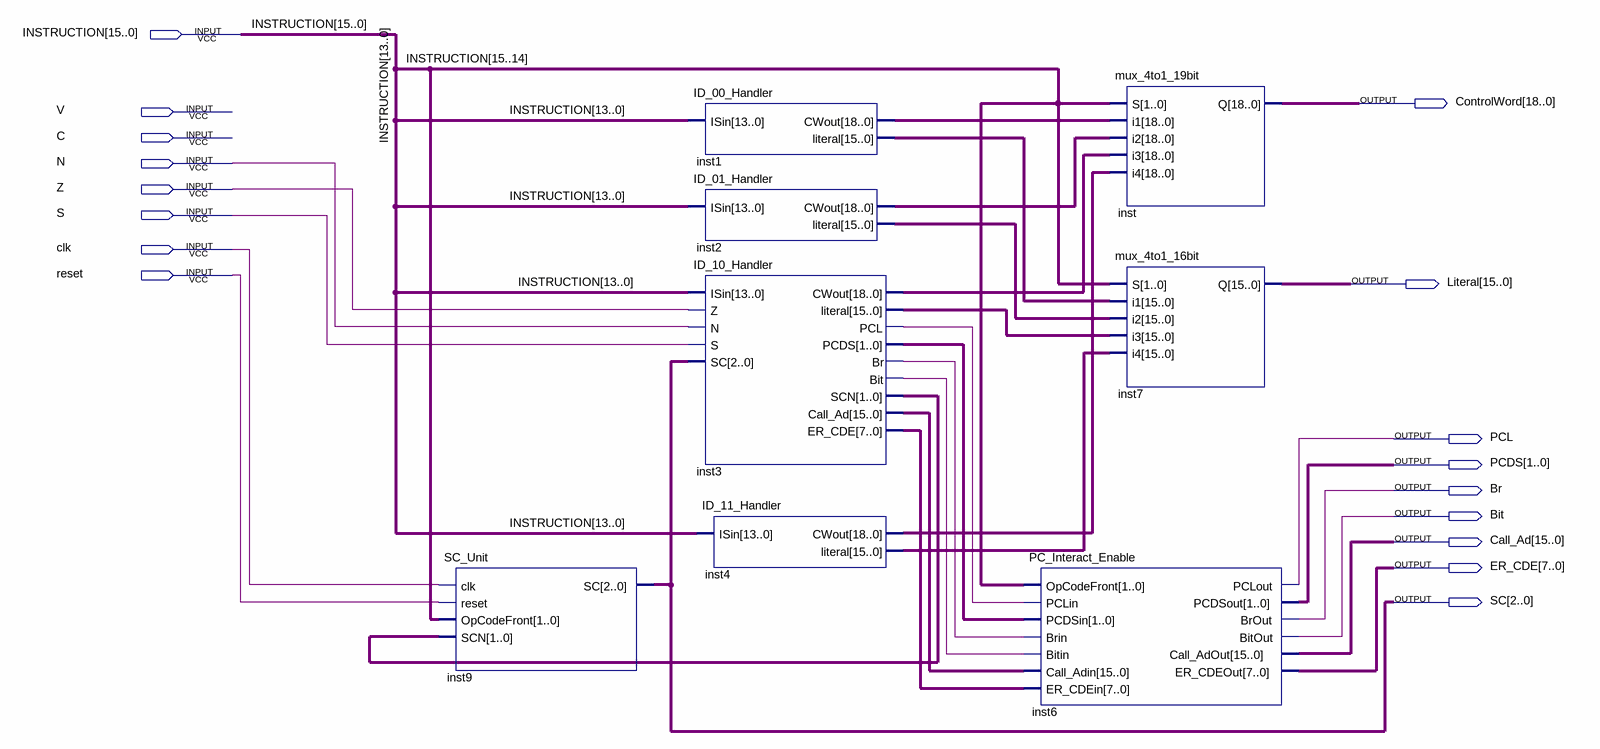
[diagram p0: schematic sheet]
// Quartus schematic InstructionDecoder.bdf as structural Verilog: 8 symbols, 17 pins
module InstructionDecoder (
  input  [15:0] INSTRUCTION,
  input  V,
  input  C,
  input  N,
  input  Z,
  input  S,
  input  clk,
  input  reset,
  output [18:0] ControlWord,
  output [15:0] Literal,
  output PCL,
  output [1:0] PCDS,
  output Br,
  output Bit,
  output [15:0] Call_Ad,
  output [7:0] ER_CDE,
  output [2:0] SC
);

  wire inst3_bit, inst3_br, inst3_pcl;
  wire [1:0] inst3_pcds, inst3_scn;
  wire [7:0] inst3_er_cde;
  wire [15:0] inst1_literal, inst2_literal, inst3_call_ad, inst3_literal, inst4_literal;
  wire [18:0] inst1_cwout, inst2_cwout, inst3_cwout, inst4_cwout;

  SC_Unit inst9 (.clk(clk), .reset(reset), .OpCodeFront(INSTRUCTION), .SCN(inst3_scn), .SC(SC));
  ID_00_Handler inst1 (.ISin(INSTRUCTION[13:0]), .CWout(inst1_cwout), .literal(inst1_literal));
  ID_01_Handler inst2 (.ISin(INSTRUCTION[13:0]), .CWout(inst2_cwout), .literal(inst2_literal));
  ID_10_Handler inst3 (
    .ISin(INSTRUCTION[13:0]), .Z(Z), .N(N), .S(S), .SC(SC), .CWout(inst3_cwout), .literal(inst3_literal),
    .PCL(inst3_pcl), .PCDS(inst3_pcds), .Br(inst3_br), .Bit(inst3_bit), .SCN(inst3_scn),
    .Call_Ad(inst3_call_ad), .ER_CDE(inst3_er_cde));
  ID_11_Handler inst4 (.ISin(INSTRUCTION[13:0]), .CWout(inst4_cwout), .literal(inst4_literal));
  PC_Interact_Enable inst6 (
    .OpCodeFront(INSTRUCTION[15:14]), .PCLin(inst3_pcl), .PCDSin(inst3_pcds), .Brin(inst3_br),
    .Bitin(inst3_bit), .Call_Adin(inst3_call_ad), .ER_CDEin(inst3_er_cde), .PCLout(PCL), .PCDSout(PCDS),
    .BrOut(Br), .BitOut(Bit), .Call_AdOut(Call_Ad), .ER_CDEOut(ER_CDE));
  mux_4to1_19bit inst (
    .S(INSTRUCTION[15:14]), .i1(inst1_cwout), .i2(inst2_cwout), .i3(inst3_cwout), .i4(inst4_cwout),
    .Q(ControlWord));
  mux_4to1_16bit inst7 (
    .S(INSTRUCTION[15:14]), .i1(inst1_literal), .i2(inst2_literal), .i3(inst3_literal), .i4(inst4_literal),
    .Q(Literal));
endmodule
